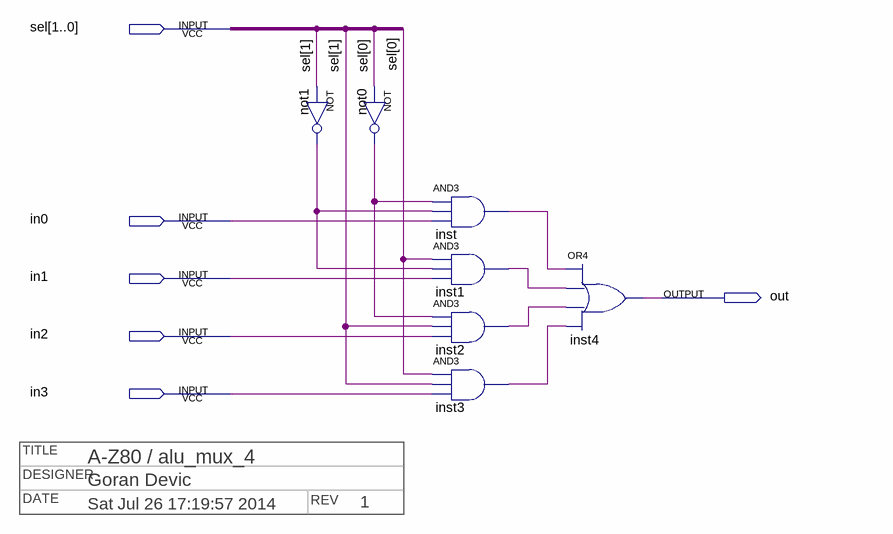
[diagram p0: schematic sheet]
// Quartus schematic alu_mux_4.bdf as structural Verilog: 7 symbols, 6 pins
// Title block: DATE: Sat Jul 26 17:19:57 2014; DESIGNER: Goran Devic; REV: 1; TITLE: A-Z80 / alu_mux_4
module alu_mux_4 (
  input  [1:0] sel,
  input  in0,
  input  in1,
  input  in2,
  input  in3,
  output out
);

  wire inst1_out, inst2_out, inst3_out, inst_out, not0_out, not1_out;

  not not1 (not1_out, sel[1]);
  not not0 (not0_out, sel[0]);
  and inst (inst_out, not0_out, not1_out, in0);
  and inst1 (inst1_out, sel[0], not1_out, in1);
  and inst2 (inst2_out, not0_out, sel[1], in2);
  and inst3 (inst3_out, sel[0], sel[1], in3);
  or inst4 (out, inst_out, inst1_out, inst2_out, inst3_out);
endmodule
